# Altium project NASCO PCB DESIGN.PrjPcb
1 sheet, 1 parts. Net scope: global (net labels, ports and power ports of the same name join across sheets).
Board file: NASCO RAILTECB-112.PcbDoc

## Sheet NASCO A4.SchDoc
size A4; Title2: Title2

### Parts
?  (no value)  (no BOM)

### Notes on the sheet
- Title
- NASCO
- Size:
- Date:
- A4
- Number:
- Revision:
- Sheet
- of
- File:

### Library data of the parts
? = NASCO_LOGO: LOGO